# EAGLE design BGCCF-PIN-V3-05 (EAGLE 4.16)
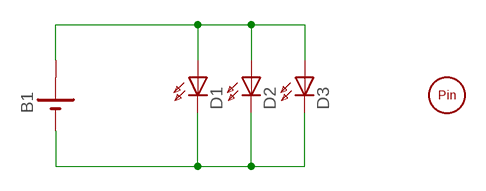
[diagram p0: schematic, sheet 1]

## Parts
B1  BATT-CLIP-FB-20-CR2032-TH  [BATT-CLIP-CR2032-TH-A]
D1  LED5MM  [LED5MM]
D2  LED5MM  [LED5MM]
D3  LED5MM  [LED5MM]
PIN1  PIN-0.25DIA  [PIN-B]

## Nets
NEG: B1.P$3(-) D1.K(C) D2.K(C) D3.K(C)
POS: B1.P$1(+) D1.A D2.A D3.A
Unconnected: B1.P$2(+)

## Library data of the parts
B1 = avn-power:BATT-CLIP-FB-20-CR2032: Battery Clip for Polycase FB-20 Key Fob Enclosure Uses CR-2032 battery.
D1-D3 = avn-led:LED: LED
PIN1 = avn:PIN: Fabric mounting pin

## Net classes
0 default: width 0.508 mm

## Board
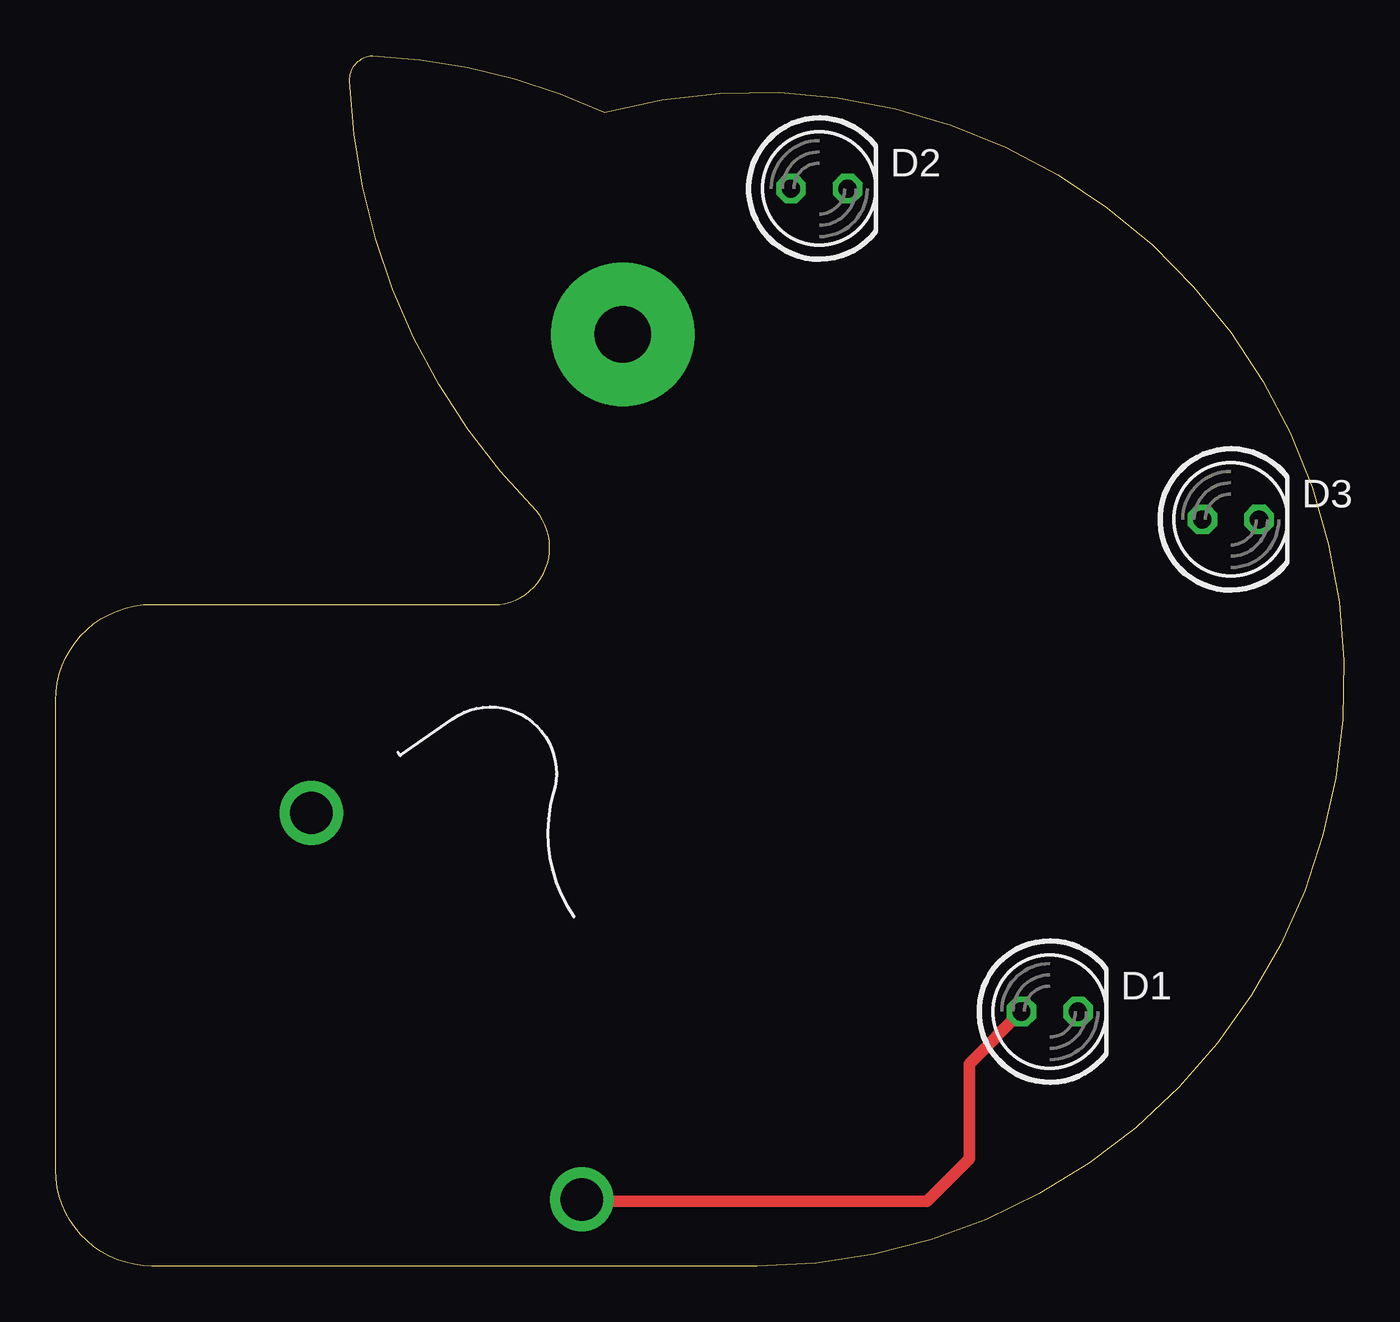
[diagram p1: board, top side]
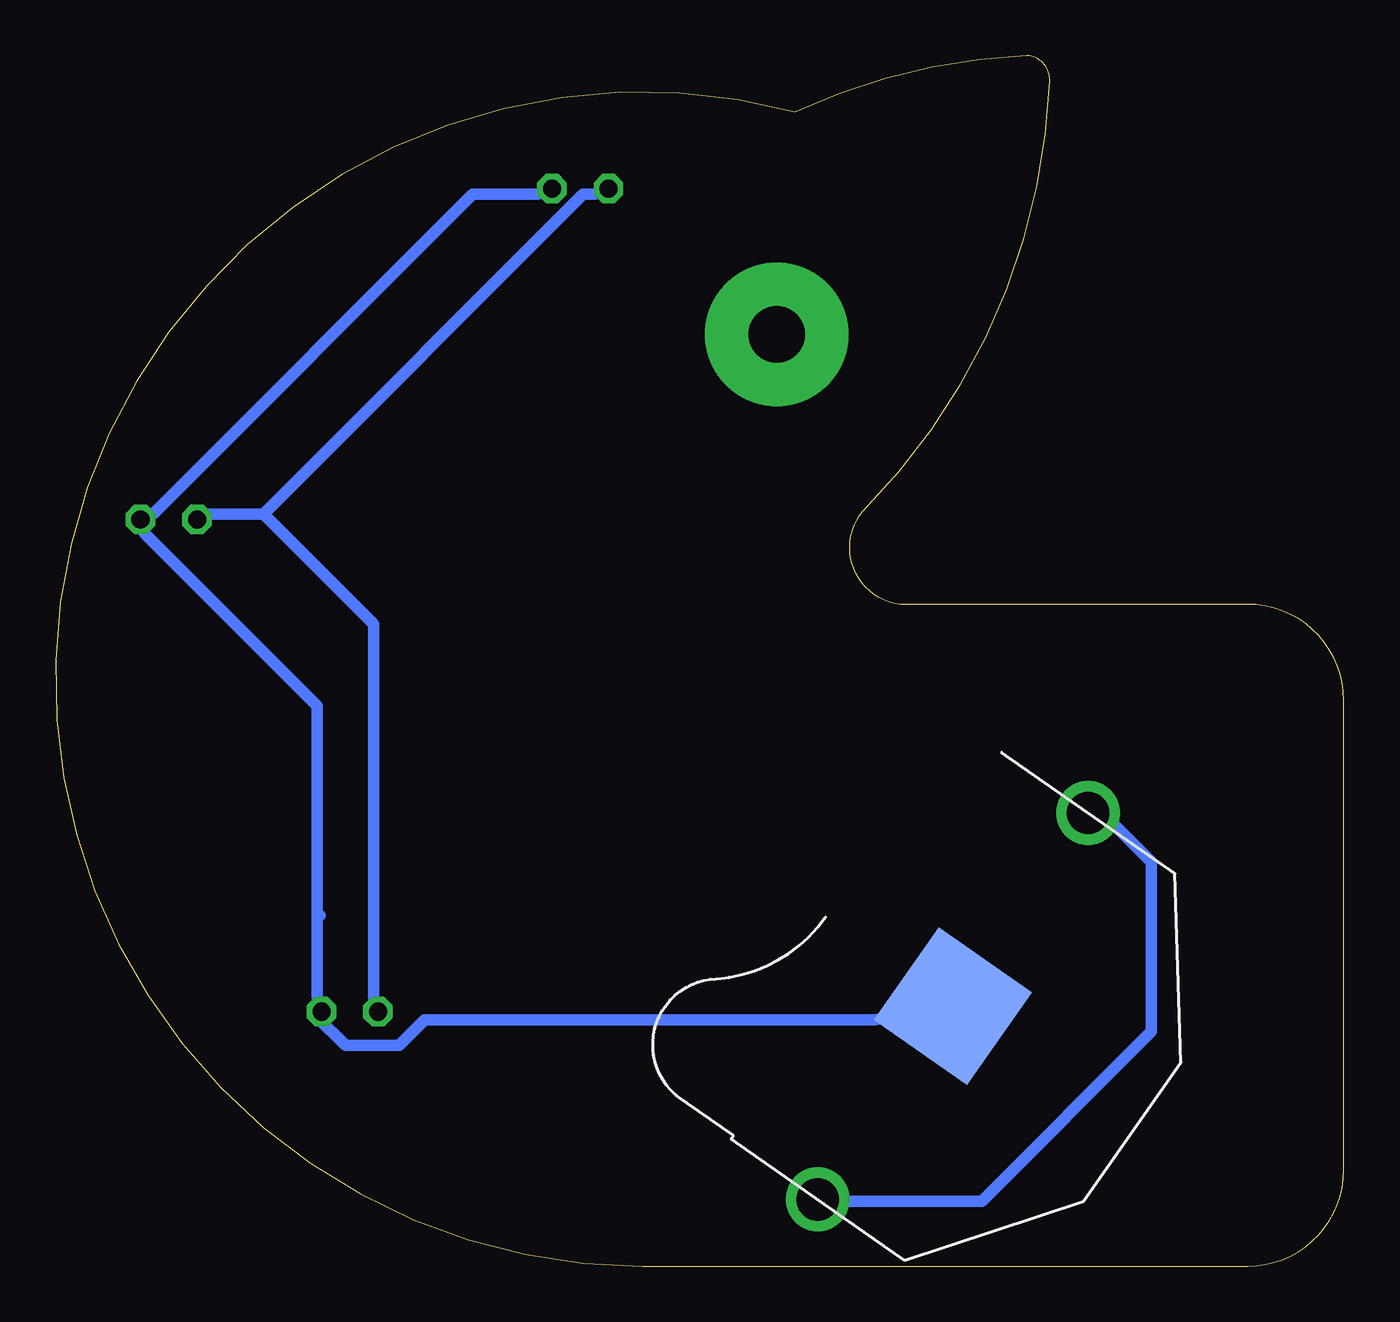
[diagram p2: board, bottom side, seen from below]

Size 57.84 x 54.36 mm. Coordinates in mm from the lower left corner, seen from the top.
Outline: 0,4.32 0,25.4 arc-90 4.32,29.72 19.94,29.72 arc123 21.59,33.91 arc-43 13.21,53.21 arc-90 14.22,54.36 arc-22 24.64,51.82 arc-195 31.5,0 4.32,0 arc-90 0,4.32
Copper layers (1*16): Top 0.035mm / dielectric 1.5mm / Bottom 0.035mm
Design rules "default": minimum track width 10mil, minimum drill 24mil, track to track 8mil, track to pad 8mil, pad to pad 8mil, via to via 8mil, smd to smd 8mil, copper to edge 40mil, drill to drill 8mil, minimum pad ring 10mil, minimum via ring 8mil, stop-mask expansion 4mil, vias tented up to drill 0mil, thermal gap 10mil
Milling: 10 lines

### Footprints (pad centres in the part's own frame; a part is rotated, then mirrored left to right if it is on the bottom)
BATT-CLIP-CR2032-TH-A = drill 1.905 round: P$1 -10.592,0; P$2 10.592,0 | smd 5.08 x 5.08: P$3 0,0
LED5MM = drill 0.813 octagon: A -1.27,0; K 1.27,0
PIN-B = drill 2.54 pad 6.452 round: P$1 0,0

### Placement (x,y rotation side)
B1  17.55,11.67 55 bottom
D1  44.64,11.43 0 top
D2  34.29,48.39 0 top
D3  52.77,33.53 0 top
PIN1  25.46,41.85 0 top

### Tracks (layer width: path | path; a pad name or v marks a point on that pad's centre or on a via)
N$1
  Bottom 0.508: 23.24,2.92 16.26,2.92 8.64,10.54 8.64,18.16 10.54,20.07 11.18,20.07
NEG
  Bottom 0.508: 46.1,15.75 46.1,25.15 53.85,32.89 D3.K 53.47,33.78 39.12,48.13 36.2,48.13 D2.K | 46.1,15.75 46.1,12.07 D1.K 46.1,11.24 46.1,11.18 44.83,9.91 42.42,9.91 41.27,11.05 21.08,11.05 B1.P$3 | 46.1,15.75 45.97,15.75
POS
  Top 0.508: D1.A 41.02,9.08 41.02,4.83 39.12,2.92 23.7,2.92 B1.P$1
  Bottom 0.508: 48.51,33.78 34.16,48.13 33.66,48.13 D2.A | 48.51,33.78 50.93,33.78 D3.A | D1.A 43.56,12.07 43.56,28.83 48.51,33.78

### Text on the board
201bmp: + | + | How-to: | Insert pin from front. Solder at back | Mount battery clip on back, then solder on front | Mount LEDs to front. Long... | ...lead is (+) | Trim LEDs | Insert battery (+) side up | + | BGCCF pin v3-05